# EAGLE design main_board (EAGLE 7.3.0)
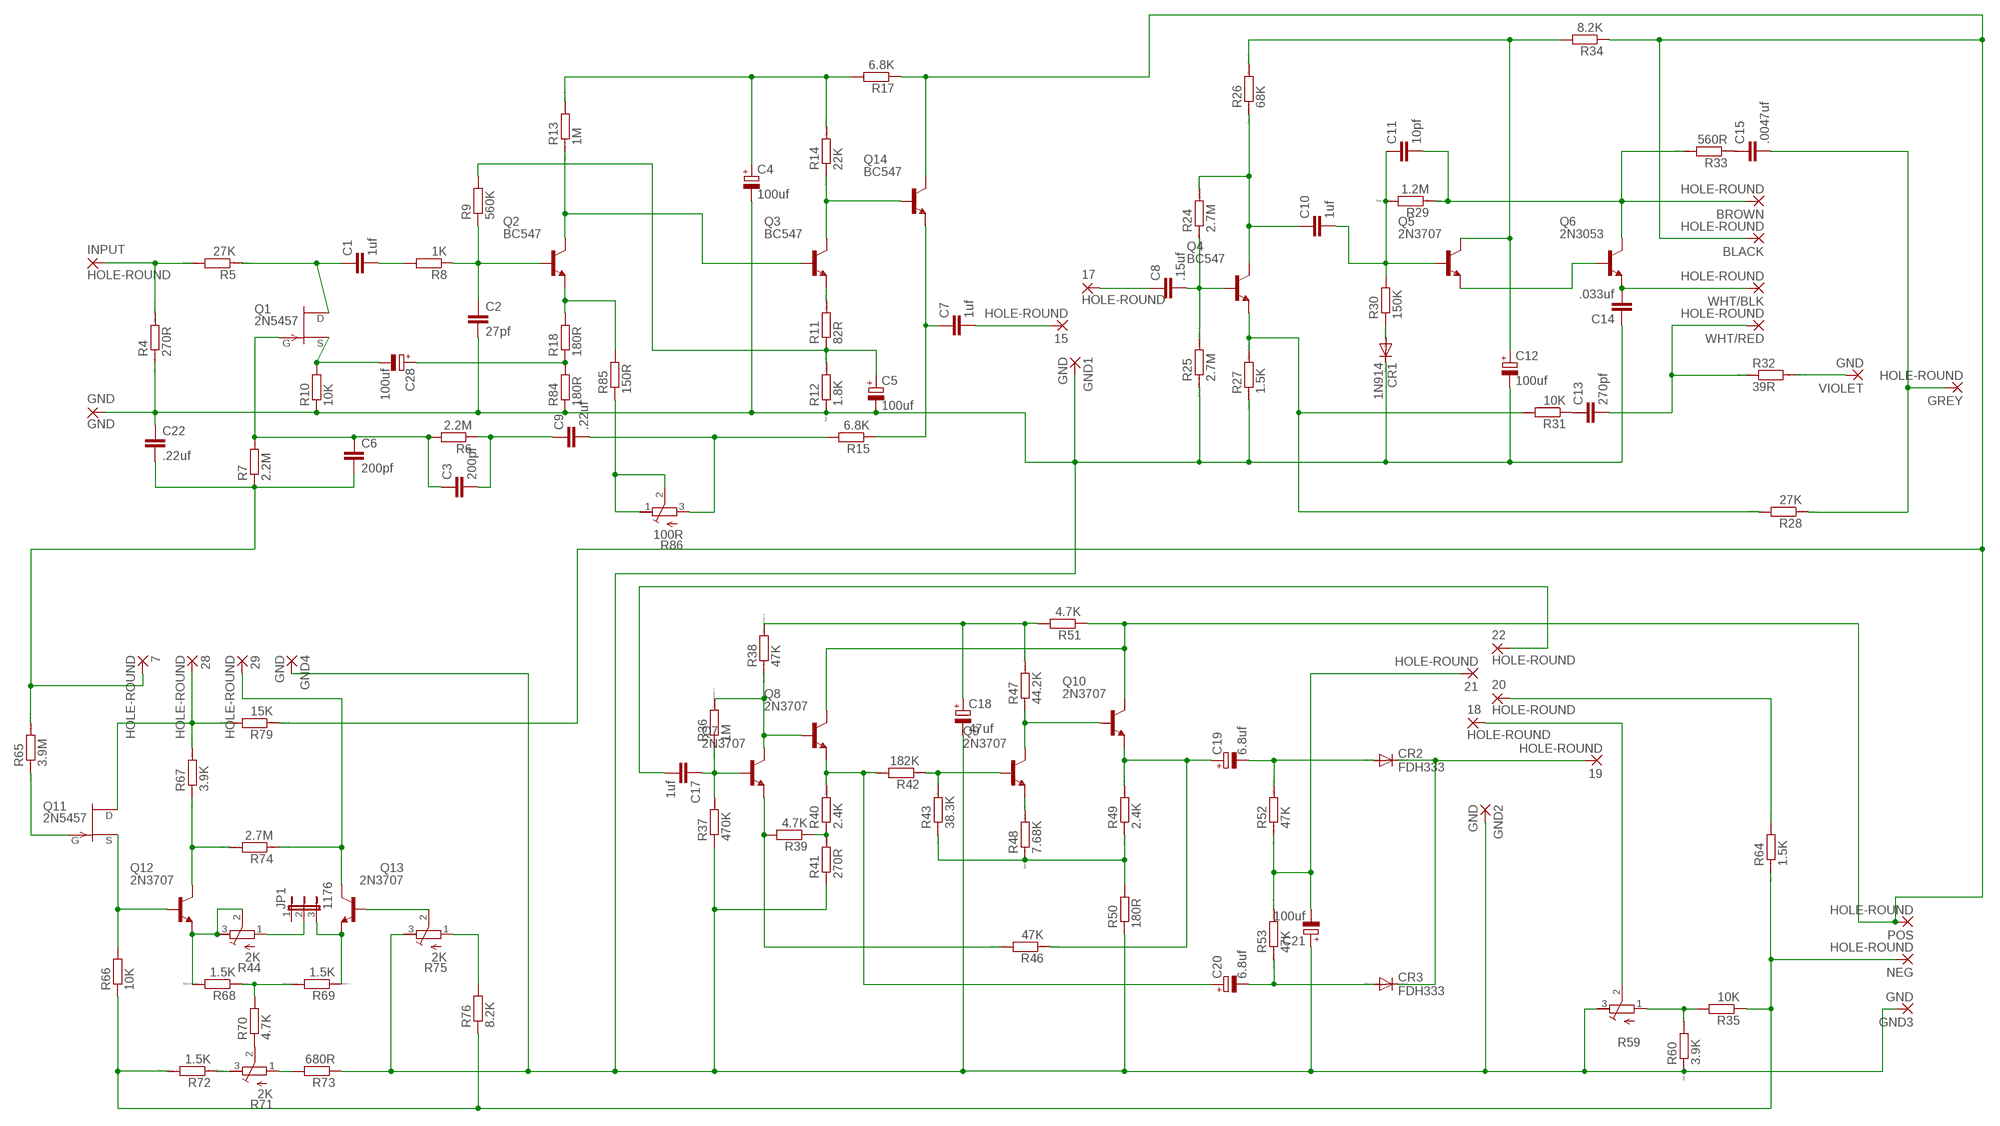
[diagram p0: schematic, sheet 1]

## Parts
7  HOLE-ROUND  [HOLE-ROUND]
15  HOLE-ROUND  [HOLE-ROUND]
17  HOLE-ROUND  [HOLE-ROUND]
18  HOLE-ROUND  [HOLE-ROUND]
19  HOLE-ROUND  [HOLE-ROUND]
20  HOLE-ROUND  [HOLE-ROUND]
21  HOLE-ROUND  [HOLE-ROUND]
22  HOLE-ROUND  [HOLE-ROUND]
28  HOLE-ROUND  [HOLE-ROUND]
29  HOLE-ROUND  [HOLE-ROUND]
BLACK  HOLE-ROUND  [HOLE-ROUND]
BROWN  HOLE-ROUND  [HOLE-ROUND]
C1  1uf  C-EU  [SQUARE]
C2  27pf  C-EU-ROUND  [C-EU-ROUND]
C3  200pf  C-EU050-024X044  [C050-024X044]
C4  100uf  CPOL-EUROUND2  [ROUND7]
C5  100uf  CPOL-EUROUND2  [ROUND7]
C6  200pf  C-EU050-024X044  [C050-024X044]
C7  1uf  C-EU  [SQUARE]
C8  .15uf  C-EU-ROUND  [C-EU-ROUND]
C9  .22uf  C-EU-ROUND  [C-EU-ROUND]
C10  1uf  C-EU  [SQUARE]
C11  10pf  C-EU075-032X103  [C075-032X103]
C12  100uf  CPOL-EUROUND2  [ROUND7]
C13  270pf  C-EU-ROUND  [C-EU-ROUND]
C14  .033uf  C-EU-ROUND  [C-EU-ROUND]
C15  .0047uf  C-EU-ROUND  [C-EU-ROUND]
C17  1uf  C-EU  [SQUARE]
C18  47uf  CPOL-EUE2.5-6  [E2,5-6]
C19  6.8uf  CPOL-EUE1.8-4  [E1,8-4]
C20  6.8uf  CPOL-EUE1.8-4  [E1,8-4]
C21  100uf  CPOL-EUROUND2  [ROUND7]
C22  .22uf  C-EU-ROUND  [C-EU-ROUND]
C28  100uf  CPOL-EUROUND2  [ROUND7]
CR1  1N914  1N4933  [DO41-10]
CR2  FDH333  1N4933  [DO41-10]
CR3  FDH333  1N4933  [DO41-10]
GND  GND  HOLE-SQUARE  [HOLE-SQUARE]
GND1  GND  HOLE-SQUARE  [HOLE-SQUARE]
GND2  GND  HOLE-SQUARE  [HOLE-SQUARE]
GND3  GND  HOLE-SQUARE  [HOLE-SQUARE]
GND4  GND  HOLE-SQUARE  [HOLE-SQUARE]
GREY  HOLE-ROUND  [HOLE-ROUND]
INPUT  HOLE-ROUND  [HOLE-ROUND]
JP1  1176  [1176]
NEG  HOLE-ROUND  [HOLE-ROUND]
POS  HOLE-ROUND  [HOLE-ROUND]
Q1  2N5457  BF245  [TO92]
Q2  BC547  [TO92]
Q3  BC547  [TO92]
Q4  BC547  [TO92]
Q5  2N3707  [TO92]
Q6  2N3053  [TO39]
Q7  2N3707  [TO92]
Q8  2N3707  [TO92]
Q9  2N3707  [TO92]
Q10  2N3707  [TO92]
Q11  2N5457  BF245  [TO92]
Q12  2N3707  [TO92]
Q13  2N3707  [TO92]
Q14  BC547  [TO92]
R4  270R  EURESROUND  [ROUND]
R5  27K  EURESROUND  [ROUND]
R6  2.2M  R-EU_0207/10  [0207/10]
R7  2.2M  R-EU_0207/10  [0207/10]
R8  1K  R-EU_0207/10  [0207/10]
R9  560K  R-EU_0207/10  [0207/10]
R10  10K  R-EU_0207/10  [0207/10]
R11  82R  EURESROUND  [ROUND]
R12  1.8K  EURESROUND  [ROUND]
R13  1M  EURESROUND  [ROUND]
R14  22K  EURESROUND  [ROUND]
R15  6.8K  R-EU_0207/10  [0207/10]
R17  6.8K  R-EU_0207/10  [0207/10]
R18  180R  R-EU_0207/10  [0207/10]
R24  2.7M  EURESROUND  [ROUND]
R25  2.7M  EURESROUND  [ROUND]
R26  68K  EURESROUND  [ROUND]
R27  1.5K  EURESROUND  [ROUND]
R28  27K  EURESROUND  [ROUND]
R29  1.2M  EURESROUND  [ROUND]
R30  150K  R-EU_0207/10  [0207/10]
R31  10K  R-EU_0207/10  [0207/10]
R32  39R  EURESROUND  [ROUND]
R33  560R  EURESROUND  [ROUND]
R34  8.2K  R-EU_0207/10  [0207/10]
R35  10K  R-EU_0207/10  [0207/10]
R36  1M  EURESROUND  [ROUND]
R37  470K  R-EU_0207/10  [0207/10]
R38  47K  EURESROUND  [ROUND]
R39  4.7K  R-EU_0207/10  [0207/10]
R40  2.4K  EURESROUND  [ROUND]
R41  270R  R-EU_0207/10  [0207/10]
R42  182K  EURESROUND  [ROUND]
R43  38.3K  EURESROUND  [ROUND]
R44  2K  R-TRIMM3296W  [RTRIM3296W]
R46  47K  EURESROUND  [ROUND]
R47  44.2K  EURESROUND  [ROUND]
R48  7.68K  EURESROUND  [ROUND]
R49  2.4K  EURESROUND  [ROUND]
R50  180R  R-EU_0207/10  [0207/10]
R51  4.7K  R-EU_0207/10  [0207/10]
R52  47K  EURESROUND  [ROUND]
R53  47K  EURESROUND  [ROUND]
R59  R-TRIMM3296W  [RTRIM3296W]
R60  3.9K  EURESROUND  [ROUND]
R64  1.5K  EURESROUND  [ROUND]
R65  3.9M  EURESROUND  [ROUND]
R66  10K  R-EU_0207/10  [0207/10]
R67  3.9K  EURESROUND  [ROUND]
R68  1.5K  EURESROUND  [ROUND]
R69  1.5K  EURESROUND  [ROUND]
R70  4.7K  R-EU_0207/10  [0207/10]
R71  2K  R-TRIMM3296W  [RTRIM3296W]
R72  1.5K  EURESROUND  [ROUND]
R73  680R  R-EU_0207/10  [0207/10]
R74  2.7M  EURESROUND  [ROUND]
R75  2K  R-TRIMM3296W  [RTRIM3296W]
R76  8.2K  R-EU_0207/10  [0207/10]
R79  15K  EURESROUND  [ROUND]
R84  180R  R-EU_0207/10  [0207/10]
R85  150R  R-EU_0207/10  [0207/10]
R86  100R  R-TRIMM3339P  [RTRIM3339P]
VIOLET  GND  HOLE-SQUARE  [HOLE-SQUARE]
WHT/BLK  HOLE-ROUND  [HOLE-ROUND]
WHT/RED  HOLE-ROUND  [HOLE-ROUND]

## Nets
GND: C2.2 C4.- C5.- C12.- C14.1 C18.- C21.+ C22.1 CR1.C GND1.1(P) GND2.1(P) GND3.1(P) GND4.1(P) GND.1(P) R4.P$1 R10.1 R12.P$1 R25.P$1 R27.P$1 R37.1 R41.1 R50.1 R59.3(E) R60.P$1 R73.1 R75.3(E) R84.1
N$1: 22.1(P) C17.2
N$2: Q11.1(G) R65.P$1
N$3: 28.1(P) Q11.3(D) R67.P$3 R79.P$3
N$4: Q11.2(S) Q12.3(B) R66.2
N$5: NEG.1(P) R35.1 R64.P$1 R66.1 R72.P$3 R76.1
N$6: R70.1 R71.2(S)
N$7: Q12.2(C) R67.P$1 R74.P$3
N$8: R68.P$1 R69.P$3 R70.2
N$9: Q12.1(E) R44.2(S) R44.3(E) R68.P$3
N$10: 20.1(P) R64.P$3
N$11: JP1.3 Q13.1(E) R69.P$1
N$12: 29.1(P) Q13.2(C) R74.P$1
N$13: R71.3(E) R72.P$1
N$14: Q13.3(B) R75.2(S)
N$15: Q3.1(C) Q14.2(B) R14.P$1
N$16: R75.1(A) R76.2
N$17: INPUT.1(P) R4.P$3 R5.P$3
N$18: JP1.2 R44.1(A)
N$19: Q4.3(E) R27.P$3 R28.P$3 R31.2
N$20: R71.1(A) R73.2
N$21: C1.1 Q1.3(D) R5.P$1
N$22: C1.2 R8.2
N$23: C3.1 C6.1 Q1.1(G) R6.2 R7.2
N$24: C28.- Q1.2(S) R10.2
N$25: C13.2 R32.P$1 WHT/RED.1(P)
N$26: C3.2 C9.1 R6.1
N$27: C28.+ R18.1 R84.2
N$28: 15.1(P) C7.2
N$29: C2.1 Q2.2(B) R8.1 R9.1
N$30: C17.1 Q7.3(B) R36.P$1 R37.2
N$31: Q2.3(E) R18.2 R85.2
N$32: C9.2 R15.2 R86.3(A)
N$33: R85.1 R86.1(E) R86.2(S)
N$34: Q2.1(C) Q3.2(B) R13.P$1
N$35: C5.+ R9.2 R11.P$1 R12.P$3
N$36: C4.+ R13.P$3 R14.P$3 R17.2
N$37: Q5.1(E) Q6.2(B)
N$38: Q3.3(E) R11.P$3
N$39: BROWN.1(P) C11.2 Q6.3(C) R29.P$1 R33.P$3
N$40: C7.1 Q14.3(E) R15.1
N$41: R35.2 R59.1(A) R60.P$3
N$42: C15.2 GREY.1(P) R28.P$1
N$43: Q7.2(C) Q8.3(B) R36.P$3 R38.P$1
N$44: 17.1(P) C8.1
N$45: C8.2 Q4.2(B) R24.P$1 R25.P$3
N$46: Q7.1(E) R39.2 R46.P$3
N$47: C10.1 Q4.1(C) R24.P$3 R26.P$1
N$48: R39.1 R40.P$1 R41.2
N$49: C10.2 C11.1 Q5.3(B) R29.P$3 R30.2
N$50: C20.- CR3.A R53.P$1
N$51: CR1.A R30.1
N$52: C18.+ R38.P$3 R47.P$3 R51.2
N$53: C12.+ Q5.2(C) R26.P$3 R34.2
N$54: C13.1 R31.1
N$55: C20.+ Q8.1(E) R40.P$3 R42.P$3
N$56: BLACK.1(P) POS.1(P) Q8.2(C) Q10.2(C) Q14.1(C) R17.1 R34.1 R51.1 R79.P$1
N$57: Q9.3(B) R42.P$1 R43.P$3
N$58: C15.1 R33.P$1
N$59: R43.P$1 R48.P$1 R49.P$1 R50.2
N$60: Q9.1(E) R48.P$3
N$61: Q9.2(C) Q10.3(B) R47.P$1
N$62: 19.1(P) CR2.C CR3.C
N$63: R32.P$3 VIOLET.1(P)
N$64: C19.+ Q10.1(E) R46.P$1 R49.P$3
N$65: 21.1(P) C21.- R52.P$1 R53.P$3
N$66: 7.1(P) C6.2 C22.2 R7.1 R65.P$3
N$67: C19.- CR2.A R52.P$3
N$69: 18.1(P) R59.2(S)
Q6: C14.2 Q6.1(E) WHT/BLK.1(P)
Unconnected: JP1.1

## Library data of the parts
7 15 17-22 28 29 BLACK BROWN GREY INPUT NEG POS WHT/BLK WHT/RED = wirepad:HOLE-ROUND
C1 C7 C10 C11 C17 = rcl:C-EU: CAPACITOR, European symbol
C2 C8 C9 C13-C15 C22 = rcl:C-EU-ROUND
C3 C6 = resistor:C-EU: CAPACITOR, European symbol
C4 C5 C12 C18-C21 C28 = rcl:CPOL-EU: POLARIZED CAPACITOR, European symbol
CR1-CR3 = diode:1N4933: DIODE fast recovery rectifier, 1A
GND GND1-GND4 VIOLET = wirepad:HOLE-SQUARE
JP1 = jumper:1176
Q1 Q11 = transistor-fet:BF245: N-Channel Junction FET http://www.onsemi.com/pub/Collateral/BF245A-D.PDF
Q2-Q4 Q14 = transistor-neu-to92:BC547: NPN TRANSISTOR
Q5 Q7-Q10 Q12 Q13 = transistor-npn:2N3707
Q6 = transistor-npn:2N3053
R4 R5 R11-R14 R24-R29 R32 R33 R36 R38 R40 R42 R43 R46-R49 R52 R53 R60 R64 R65 R67-R69 R72 R74 R79 = resistor:EURESROUND
R6-R10 R15 R17 R18 R30 R31 R34 R35 R37 R39 R41 R50 R51 R66 R70 R73 R76 R84 R85 = resistor:R-EU_: RESISTOR, European symbol
R44 R59 R71 R75 = resistor:R-TRIMM: Trimm resistor
R86 = rcl:R-TRIMM: Trimm resistor

## Board
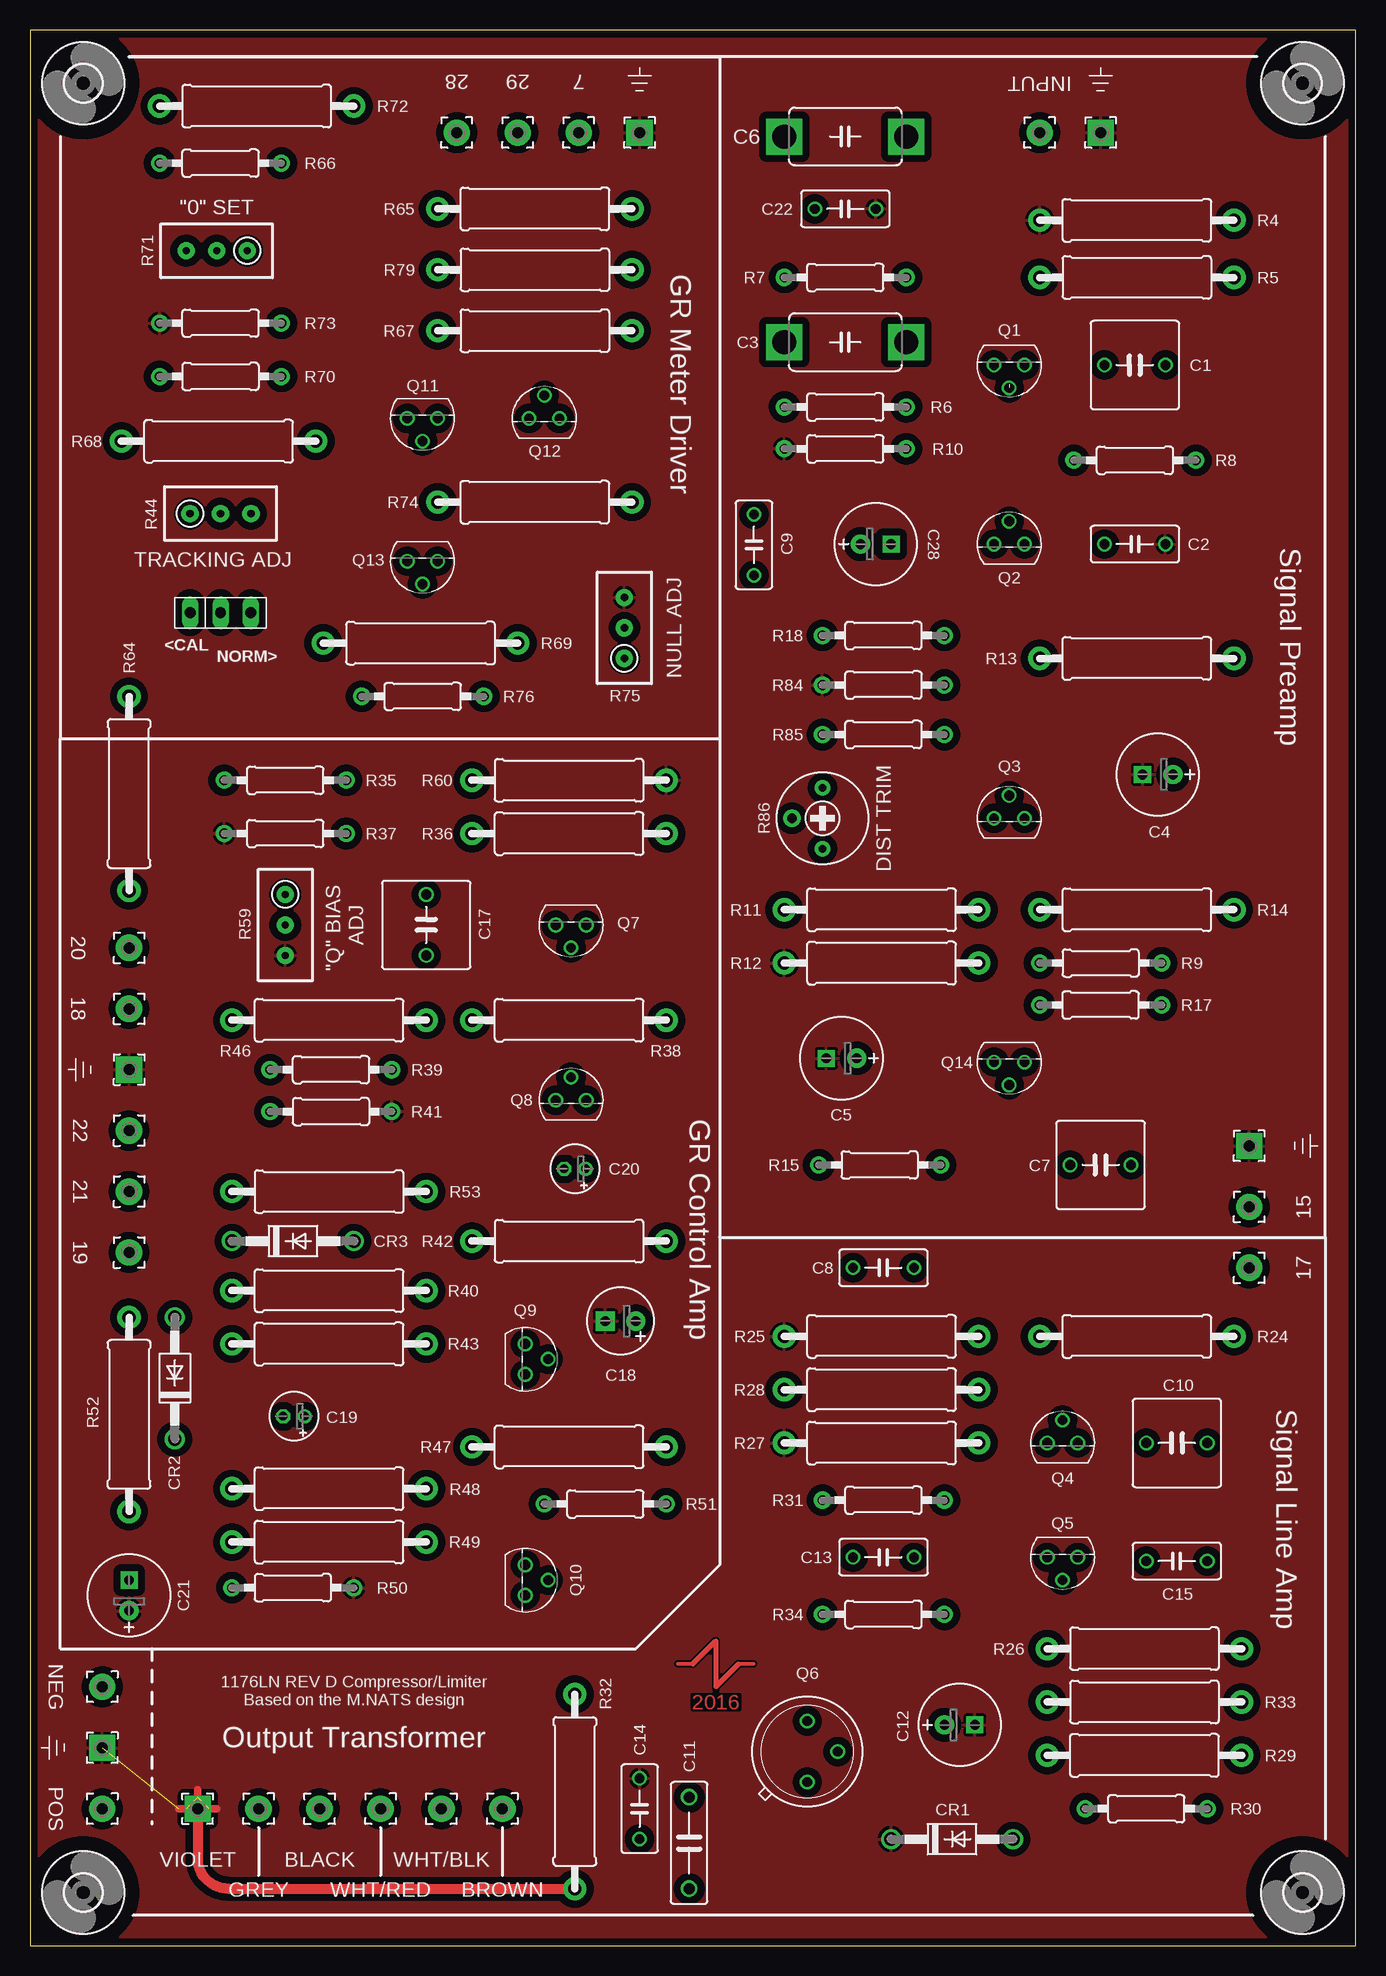
[diagram p1: board, top side]
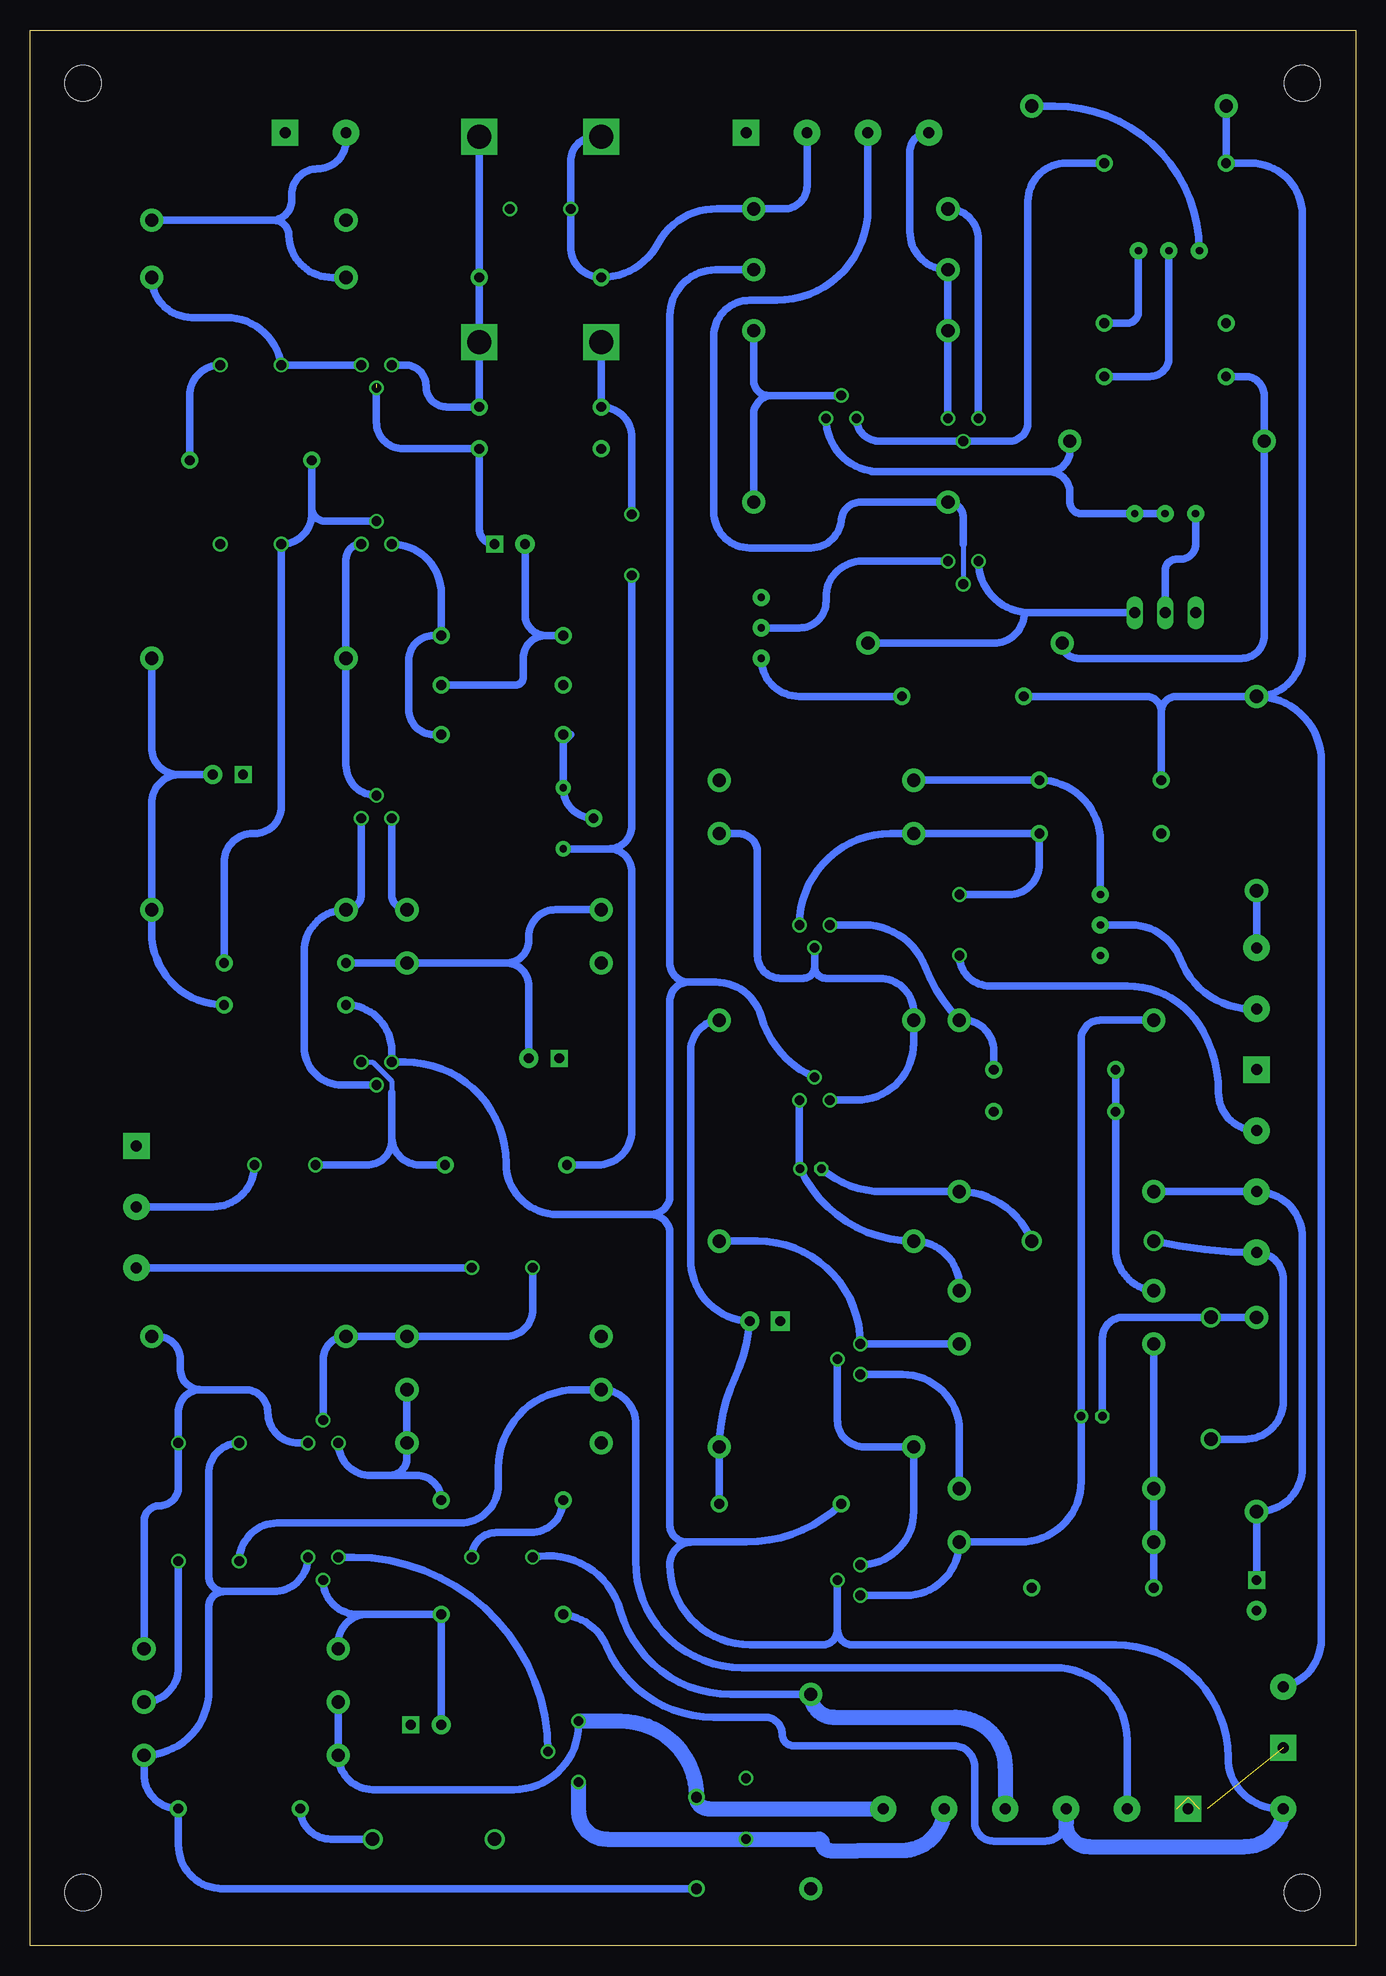
[diagram p2: board, bottom side, seen from below]

Size 110.47 x 159.69 mm. Coordinates in mm from the lower left corner, seen from the top.
Outline: 0,0 110.47,0 110.47,159.69 0,159.69 0,0
Copper layers (1*16): Top 0.0356mm / dielectric 1.5011mm / Bottom 0.0356mm
Design rules "oshpark-2layer": minimum track width 6mil, minimum drill 13mil, track to track 6mil, track to pad 6mil, pad to pad 6mil, via to via 6mil, smd to smd 6mil, copper to edge 15mil, drill to drill 6mil, minimum pad ring 7mil, minimum via ring 7mil, stop-mask expansion 2.5mil, vias tented up to drill 0mil, thermal gap 10mil

### Footprints (pad centres in the part's own frame; a part is rotated, then mirrored left to right if it is on the bottom)
HOLE-ROUND = drill 0.914 pad 2.184: 1 0,0
SQUARE = drill 0.813: 1 -2.54,0; 2 2.54,0
C-EU-ROUND = drill 0.813: 1 -2.54,0; 2 2.54,0
C050-024X044 = drill 2 square: 1 -5.08,0; 2 5.08,0
ROUND7 = drill 0.813 pad 1.6: + -1.27,0 | drill 0.813 pad 1.422 square: - 1.27,0
C075-032X103 = drill 0.914: 1 -3.81,0; 2 3.81,0
E2,5-6 = drill 0.813 pad 1.6: + -1.27,0 | drill 0.813 pad 1.6 square: - 1.27,0
E1,8-4 = drill 0.711 pad 1.168: + -0.889,0 | drill 0.711 pad 1.168 octagon: - 0.889,0
DO41-10 = drill 1.118: A 5.08,0; C -5.08,0
HOLE-SQUARE = drill 0.914 pad 2.184 square: 1 0,0
1176 = drill 0.914 long: 1 -2.54,0; 2 0,0; 3 2.54,0
TO92 = drill 0.813: 1 1.27,0; 2 0,1.905; 3 -1.27,0
TO39 = drill 0.813: 1 0,-2.54; 2 2.54,0; 3 0,2.54
ROUND = drill 1.1 pad 1.93: P$1 -8.255,0; P$3 7.938,0
0207/10 = drill 0.813 pad 1.422: 1 -5.08,0; 2 5.08,0
RTRIM3296W = drill 0.61 pad 1.422: 1 0,-2.54; 2 0,0; 3 0,2.54
RTRIM3339P = drill 0.61 pad 1.27: 1 -2.54,0; 3 2.54,0 | drill 0.8 pad 1.422: 2 0,-2.54
3,0 = hole 3: 0,0

### Placement (x,y rotation side)
7  45.72,151.13 0 top
15  101.6,61.59 90 top
17  101.6,56.52 90 top
18  8.25,78.11 90 top
19  8.25,57.78 90 top
20  8.25,83.19 90 top
21  8.25,62.87 90 top
22  8.25,67.94 90 top
28  35.56,151.13 0 top
29  40.64,151.13 0 top
BLACK  24.13,11.43 180 top
BROWN  39.37,11.43 0 top
C1  92.08,131.76 0 top
C2  92.08,116.84 0 top
C3  67.94,133.67 180 top
C4  93.98,97.63 180 top
C5  67.63,73.98 180 top
C6  67.94,150.81 180 top
C7  89.22,65.09 0 top
C8  71.12,56.52 180 top
C9  60.33,116.78 270 top
C10  95.57,41.91 180 top
C11  54.93,8.57 90 top
C12  77.47,18.41 0 top
C13  71.12,32.39 180 top
C14  50.8,11.43 270 top
C15  95.57,32.07 180 top
C17  33.02,85.09 270 top
C18  49.21,52.07 180 top
C19  21.99,44.13 180 top
C20  45.4,64.77 180 top
C21  8.25,29.21 90 top
C22  67.94,144.78 180 top
C28  70.48,116.84 0 top
CR1  76.84,8.89 0 top
CR2  12.06,47.31 90 top
CR3  21.91,58.74 0 top
GND  8.25,73.03 90 top
GND1  101.6,66.67 0 top
GND2  50.8,151.13 0 top
GND3  6.03,16.51 270 top
GND4  89.22,151.13 0 top
GREY  19.05,11.43 0 top
INPUT  84.14,151.13 0 top
JP1  15.88,111.12 0 top
NEG  6.03,21.59 270 top
POS  6.03,11.43 270 top
Q1  81.6,131.76 180 top
Q2  81.6,116.84 0 top
Q3  81.6,93.98 0 top
Q4  86.04,41.91 0 top
Q5  86.04,32.39 180 top
Q6  64.77,16.19 0 top
Q7  45.08,85.09 180 top
Q8  45.08,70.48 0 top
Q9  41.27,48.89 270 top
Q10  41.27,30.48 270 top
Q11  32.7,127.32 180 top
Q12  42.86,127.32 0 top
Q13  32.7,115.41 180 top
Q14  81.6,73.66 180 top
R4  92.39,143.83 0 top
R5  92.08,139.06 180 top
R6  67.94,128.27 0 top
R7  67.94,139.06 0 top
R8  92.08,123.83 0 top
R9  89.22,81.91 180 top
R10  67.94,124.78 0 top
R11  71.12,86.36 0 top
R12  71.12,81.91 0 top
R13  92.39,107.31 0 top
R14  92.39,86.36 0 top
R15  70.8,65.09 180 top
R17  89.22,78.42 0 top
R18  71.12,109.22 0 top
R24  92.39,50.8 0 top
R25  71.12,50.8 0 top
R26  92.71,24.77 180 top
R27  71.12,41.91 0 top
R28  71.12,46.36 0 top
R29  93.03,15.88 0 top
R30  93.03,11.43 0 top
R31  71.12,37.15 0 top
R32  45.4,12.7 270 top
R33  92.71,20.32 180 top
R34  71.12,27.62 0 top
R35  21.27,97.16 0 top
R36  45.08,92.71 0 top
R37  21.27,92.71 0 top
R38  45.08,77.15 0 top
R39  25.08,73.03 0 top
R40  25.08,54.61 0 top
R41  25.08,69.53 180 top
R42  44.77,58.74 180 top
R43  25.08,50.16 0 top
R44  15.88,119.38 270 top
R46  25.08,77.15 0 top
R47  45.08,41.59 0 top
R48  25.08,38.1 0 top
R49  25.08,33.66 0 top
R50  21.91,29.84 180 top
R51  47.94,36.83 0 top
R52  8.25,44.45 90 top
R53  24.77,62.87 180 top
R59  21.27,85.09 180 top
R60  44.77,97.16 180 top
R64  8.25,95.88 270 top
R65  42.23,144.78 0 top
R66  15.88,148.59 0 top
R67  41.91,134.62 180 top
R68  15.88,125.41 0 top
R69  32.38,108.59 180 top
R70  15.88,130.81 180 top
R71  15.56,141.29 90 top
R72  18.73,153.35 180 top
R73  15.88,135.25 0 top
R74  42.23,120.33 0 top
R75  49.53,109.85 0 top
R76  32.73,104.15 0 top
R79  41.91,139.7 180 top
R84  71.12,105.09 0 top
R85  71.12,100.97 0 top
R86  66.04,93.98 270 top
U$1  [3,0]  106.05,155.26 0 top
U$2  [3,0]  106.05,4.45 0 top
U$3  [3,0]  4.44,4.45 0 top
U$4  [3,0]  4.44,155.26 0 top
VIOLET  13.97,11.43 180 top
WHT/BLK  34.29,11.43 180 top
WHT/RED  29.21,11.43 0 top

### Tracks (layer width: path | path; a pad name or v marks a point on that pad's centre or on a via)
GND  (3 unrouted)
  Top 0.61: 13.97,12.38 13.97,13.02 | 12.38,11.43 13.02,11.43 | 14.92,11.43 15.56,11.43
  pour Top (isolate 0.61): 0,0 0,159.7 100.33,159.7 110.49,159.38 110.49,0
N$1
  Bottom 0.61: C17.2 arc-90 30.48,80.01 19.05,80.01 arc62 12.7,76.2 arc28 11.43,71.12 arc-90 22.1
N$2
  Bottom 0.61: Q11.1 31.43,142.24 arc-90 R65.P$1
N$3
  Bottom 0.61: Q11.3 R67.P$3 R79.P$3 arc90 37.15,142.88 37.15,149.54 arc90 28.1
N$4
  Bottom 0.61: 39.69,125.41 40,125.41 | R66.2 24.13,148.59 arc-90 27.3,145.42 27.3,127 arc90 28.89,125.41 Q11.2 39.37,125.41 39.69,125.41 | Q12.3 arc-90 39.69,125.41
N$5
  Bottom 0.61: R72.P$3 R66.1 8.73,148.59 arc90 4.44,144.3 4.44,107.95 arc90 R64.P$1 | R64.P$1 arc90 2.86,98.74 2.86,25.56 arc77 NEG.1 | R35.1 16.19,102.87 | 16.19,102.87 arc90 14.92,104.14 R64.P$1 | R76.1 arc-90 R76.1 17.46,104.14 arc90 16.19,102.87
N$6
  Bottom 0.61: R71.2 15.56,132.4 arc90 17.14,130.81 17.78,130.81 R70.1
N$7
  Bottom 0.61: R74.P$3 50.17,127.64 arc90 48.58,129.22 | 48.58,129.22 Q12.2 | R67.P$1 50.17,130.49 arc-90 48.89,129.22 48.58,129.22
N$8
  Bottom 0.61: R70.2 9.21,130.81 arc90 7.62,129.22 R68.P$1 7.62,109.22 arc90 9.52,107.31 23.18,107.31 arc90 R69.P$3
N$9
  Bottom 0.61: R44.2 R44.3 22.86,119.38 arc90 23.81,120.33 23.81,121.13 arc-90 25.56,122.87 | 40.32,122.87 39.69,122.87 | 39.69,122.87 25.56,122.87 | Q12.1 arc-90 39.69,122.87 | 25.56,122.87 arc-90 23.81,124.62 R68.P$3
N$10
  Bottom 0.61: R64.P$3 20.1
N$11
  Bottom 0.61: JP1.3 27.15,111.12 | 27.15,111.12 27.62,111.12 arc90 30.16,108.59 R69.P$1 | Q13.1 arc-90 27.15,111.12
N$12
  Bottom 0.406: 32.7,116.84 Q13.2
  Bottom 0.61: 29.1 40.64,144.78 arc90 48.26,137.16 50.48,137.16 arc-90 53.5,134.14 53.5,119.54 arc-90 50.48,116.52 45.4,116.52 arc-82 42.86,118.75 arc90 41.27,120.33 R74.P$1 arc90 32.7,119.06 32.7,116.84
N$13
  Bottom 0.61: R72.P$1 25.08,153.35 arc90 R71.3
N$14
  Bottom 0.61: R75.2 46.36,109.85 arc-90 44.13,112.08 44.13,112.4 arc90 41.12,115.41 Q13.3
N$15
  Bottom 0.61: Q3.1 82.87,87.63 arc90 R14.P$1 arc-90 87.63,82.87 87.63,74.93 arc-90 84.45,71.75 Q14.2
N$16
  Bottom 0.61: R75.1 arc-90 46.36,104.15 R76.2
N$17
  Bottom 0.61: INPUT.1 84.14,150.5 arc90 86.52,148.11 arc-90 88.66,145.97 88.66,145.49 arc90 90.33,143.83 | R5.P$3 85.25,139.06 arc90 88.9,142.56 arc-90 90.17,143.83 90.33,143.83 | R4.P$3 90.33,143.83
N$18
  Bottom 0.61: R44.1 13.33,116.84 arc90 14.6,115.57 14.92,115.57 arc-90 15.88,114.62 JP1.2
N$19
  Bottom 0.61: R28.P$3 R27.P$3 79.06,40.64 arc90 80.49,39.21 | Q4.3 arc-90 82.07,39.21 80.49,39.21 | 80.49,39.21 78.26,39.21 arc90 R31.2
N$20
  Bottom 0.61: R71.1 18.1,136.21 arc90 19.05,135.25 19.37,135.25 R73.2
N$21
  Bottom 0.61: Q1.3 C1.1 arc-82 94.14,135.73 97,135.73 arc90 R5.P$1
N$22
  Bottom 0.61: C1.2 arc-90 97.16,129.22 R8.2
N$23
  Bottom 0.61: C6.1 R7.2 C3.1 R6.2 75.72,128.27 arc90 77.47,130.02 arc-90 79.22,131.76 Q1.1
N$24  (1 unrouted)
  Bottom 0.61: 81.6,130.18 81.6,127 arc-90 79.38,124.78 R10.2 73.03,118.11 arc-90 C28.-
N$25
  Bottom 0.61: R32.P$1 52.07,20.95 arc74 61.28,27.94 arc-86 C13.2
  Bottom 1.27: R32.P$1 arc-90 43.5,19.05 33.34,19.05 arc90 29.21,14.92 WHT/RED.1
N$26
  Bottom 0.61: C3.2 R6.1 arc90 60.33,125.73 C9.1
N$27
  Bottom 0.61: C28.+ 69.22,110.97 arc-90 67.47,109.22 | 67.47,109.22 R18.1 | R84.2 70.01,105.09 arc-90 69.37,105.73 69.37,107.31 arc90 67.47,109.22
N$28
  Bottom 0.61: 15.1 95.25,61.59 arc-90 C7.2
N$29
  Bottom 0.61: R8.1 87,119.86 | 87,119.86 87,119.38 arc90 C2.1 89.53,94.93 arc90 91.76,92.71 91.92,92.71 arc-90 94.3,90.33 R9.1 | Q2.2 85.88,118.75 arc90 87,119.86
N$30
  Bottom 0.61: Q7.3 arc90 38.73,92.71 R36.P$1 R37.2 26.35,90.17 arc90 28.89,87.63 C17.1
N$31
  Bottom 0.61: Q2.3 arc90 76.2,112.71 R18.2 76.84,109.22 arc-90 78.9,107.16 78.9,103.03 arc-90 76.84,100.97 R85.2
N$32
  Bottom 0.61: 62.23,91.44 R86.3 | C9.2 60.33,93.34 arc90 62.23,91.44 | 62.23,91.44 arc90 60.33,89.53 60.33,67.94 arc90 63.18,65.09 R15.2
N$33
  Bottom 0.61: R85.1 65.41,100.97 66.04,100.33 R86.1 arc-90 R86.2
N$34
  Bottom 0.61: Q2.1 arc-90 84.14,115.57 R13.P$1 84.14,98.42 arc-90 Q3.2
N$35
  Bottom 0.61: R9.2 R12.P$3 70.8,81.91 | R11.P$1 66.67,86.36 arc-90 68.9,84.14 68.9,83.82 arc90 70.8,81.91 | C5.+ 68.9,80.01 arc-90 70.8,81.91
N$36
  Bottom 0.61: R13.P$3 100.33,99.85 arc-90 98.11,97.63 97.95,97.63 | R17.2 arc90 100.33,84.45 R14.P$3 100.33,95.25 arc90 97.95,97.63 | C4.+ 97.63,97.63 97.95,97.63
N$37
  Bottom 0.61: Q5.1 83.5,32.39 arc90 Q6.2
N$38
  Bottom 0.61: Q3.3 80.33,87.63 arc-90 R11.P$3
N$39
  Bottom 0.61: R33.P$3 R29.P$1 arc-90 81.92,13.02 70.17,13.02 arc-90 64.77,18.41 Q6.3
  Bottom 1.27: BROWN.1 53.97,11.43 arc90 C11.2 arc-90 61.28,18.73 Q6.3
N$40
  Bottom 0.406: Q14.3 81.92,73.66 80.33,72.07 80.33,71.12
  Bottom 0.61: R15.1 77.79,65.09 arc90 80.33,67.31 | C7.1 82.23,65.09 arc-90 80.33,67.31 | 80.33,67.31 80.33,71.12
N$41
  Bottom 0.61: R60.P$3 R35.2 arc90 21.27,92.08 R59.1
N$42
  Bottom 0.61: GREY.1 19.05,17.15 arc-90 25.08,23.18 51.12,23.18 arc90 60.01,32.07 60.01,43.18 arc-96 R28.P$1 64.93,46.36 arc-90 71.44,39.85 71.44,38.42 arc90 74.61,35.24 89.85,35.24 arc-90 C15.2
N$43
  Bottom 0.61: R36.P$3 51.44,92.71 arc90 49.85,91.12 49.85,82.55 arc-90 47.94,80.64 46.04,80.64 arc-90 45.08,81.6 | Q8.3 41.59,70.48 arc-90 36.83,75.25 R38.P$1 36.83,77.79 arc-90 39.69,80.64 44.13,80.64 arc90 45.08,81.6 | 45.08,81.6 Q7.2
N$44
  Bottom 0.61: 17.1 C8.1
N$45
  Bottom 0.61: C8.2 68.58,53.02 arc90 70.8,50.8 R25.P$3 R24.P$1 arc-90 86.04,48.89 Q4.2
N$46
  Bottom 0.61: Q7.1 40.96,85.09 arc69 35.88,81.6 arc-24 R46.P$3 arc97 30.16,74.61 R39.2
N$47
  Bottom 0.61: Q4.1 88.11,41.91 arc90 90.65,44.45 arc-90 92.55,46.36 96.2,46.36 | R24.P$3 99.85,50.8 arc90 97.95,48.89 97.95,48.1 arc-90 96.2,46.36 | 96.2,46.36 arc-90 98.11,44.45 C10.1 98.11,38.26 arc90 99.7,36.67 arc-90 100.97,35.4 R26.P$1
N$48
  Bottom 0.61: R39.1 R41.2 20,58.1 arc-85 R40.P$1
N$49
  Bottom 0.61: C11.1 94.14,4.76 94.46,4.76 | 94.46,4.76 94.62,4.76 | 95.57,20.95 95.57,21.27 | 95.57,21.27 95.57,28.26 arc90 94.3,29.53 | 94.3,29.53 90.17,29.53 arc-90 Q5.3 | C10.2 arc-90 95.57,39.37 95.57,30.8 arc-90 94.3,29.53 | 95.57,21.27 arc90 R29.P$3 100.97,14.29 arc-90 R30.2 98.11,8.41 arc-90 94.46,4.76
N$50
  Bottom 0.61: CR3.A arc-69 R53.P$1 39.37,62.87 arc41 C20.-
N$51
  Bottom 0.61: R30.1 arc-90 85.41,8.89 CR1.A
N$52
  Bottom 0.61: R51.2 R47.P$3 arc25 51.75,47.31 arc-20 C18.+ arc90 55.4,57.31 55.4,74.45 arc90 R38.P$3
N$53
  Bottom 0.61: C12.+ R34.2 82.39,27.62 | 82.39,27.62 83.19,27.62 arc90 Q5.2 | R26.P$3 84.77,25.24 arc90 82.39,27.62
N$54
  Bottom 0.61: C13.1 arc90 71.6,34.45 68.74,34.45 arc-90 R31.1
N$55
  Bottom 0.61: 46.04,64.83 C20.+ | Q8.1 46.36,64.83 C20.+ | C20.+ arc-65 R42.P$3 arc95 R40.P$3
N$56
  Bottom 0.61: 31.75,10.32 31.75,14.92 arc-90 33.5,16.67 46.83,16.67 arc90 47.78,17.62 arc-90 49.21,19.05 53.5,19.05 arc67 62.39,24.92 arc-61 R34.1 | 31.75,10.32 31.75,10.16 | 43.18,26.35 Q10.2 | 58.74,60.96 66.52,60.96 arc90 70.8,65.25 arc-90 79.22,73.66 Q14.1 80.33,74.61 arc-90 R17.1 | R79.P$1 53.34,139.7 arc-90 57.15,135.89 57.15,81.91 arc-90 55.56,80.33 | 55.56,80.33 53.34,80.33 arc74 49.53,77.47 arc-50 Q8.2 | 55.26,33.66 50.8,33.66 arc-44 R51.1 | POS.1 6.35,11.43 arc90 10.64,15.72 arc-90 20,25.08 41.91,25.08 arc90 43.18,26.35 | 24.13,10.48 arc90 25.88,8.73 30.16,8.73 arc90 31.75,10.32 | 55.56,80.33 arc-90 57.15,78.74 57.15,62.55 arc90 58.74,60.96 | 58.74,60.96 arc90 57.15,59.37 57.15,35.08 arc-90 55.72,33.66 55.26,33.66 | 55.26,33.66 arc-90 57.15,31.77 arc-90 50.46,25.08 44.45,25.08 arc-90 43.18,26.35
  Bottom 1.27: BLACK.1 24.13,10.48 24.13,10.16 arc-90 22.23,8.26 9.21,8.26 arc-90 POS.1
N$57
  Bottom 0.61: R42.P$1 49.85,58.74 arc90 Q9.3 R43.P$3
N$58
  Bottom 0.61: C15.1 98.11,23.18 arc90 R33.P$1
N$59
  Bottom 0.61: R43.P$1 R48.P$1 R49.P$1 R50.2
N$60
  Bottom 0.61: 33.02,42.86 33.02,42.55 | 33.02,42.55 R48.P$3 | Q9.1 37.78,47.62 arc94 33.02,42.55
N$61
  Bottom 0.61: Q9.2 43.18,43.81 arc-90 40.96,41.59 R47.P$1 36.83,36.2 arc90 Q10.3
N$62
  Bottom 0.61: CR3.C arc-13 19.1 arc90 6.03,55.56 6.03,45.4 arc90 9.21,42.23 CR2.C
N$63
  Top 0.813: VIOLET.1 13.97,7.3 | 13.97,7.3 13.97,6.98 | R32.P$3 16.51,4.76 arc-90 13.97,7.3
N$64
  Bottom 0.61: Q10.1 37.47,29.21 arc-90 R49.P$3 27.94,33.66 arc-90 22.88,38.72 C19.+ 22.88,75.55 arc90 21.27,77.15 R46.P$1
N$65
  Bottom 0.61: R53.P$3 21.1 arc85 4.44,59.37 4.44,39.85 arc90 8.1,36.2 R52.P$1 C21.-
N$66
  Bottom 0.61: 7.1 45.72,146.69 arc90 47.62,144.78 R65.P$3 53.18,144.78 arc-64 58.1,141.92 arc62 R7.1 arc90 65.41,141.61 C22.2 65.41,148.75 arc90 63.34,150.81 C6.2
N$67
  Bottom 0.61: R52.P$3 CR2.A 19.37,52.39 arc-90 21.1,50.66 C19.-
N$68
  Top 0.305: 53.97,23.49 55.25,23.49 | 59.05,23.49 60.33,23.49
  Top 0.406: 55.25,23.49 57.15,25.4 57.15,21.59 59.05,23.49
N$69
  Bottom 0.61: R59.2 18.73,85.09 arc69 14.6,82.23 arc-73 18.1
N$70
  pour Top: 52.07,26.67 60.96,26.67 60.96,17.15 52.07,17.15
Q6
  Bottom 1.27: Q6.1 64.77,11.27 arc-90 62.39,8.89 C14.2 44.77,8.89 arc90 44.45,8.57 arc-90 43.81,7.94 41.43,7.94 39.05,7.94 37.78,7.94 arc-90 WHT/BLK.1

### Text on the board
Top: 2016
tPlace: "0" SET | GR Meter Driver | TRACKING ADJ | NULL ADJ | Signal Preamp | <CAL | NORM> | DIST TRIM | "Q" BIAS / ADJ | GR Control Amp | Signal Line Amp | 1176LN REV D Compressor/Limiter / Based on the M.NATS design | Output Transformer